# EasyEDA Pro project ProPrj_Inverted_MAML_6x6_2026-09-04(1).epro, schematic fpga_t120_etc2
Create Date: 2025-12-23; Page Name: P1; Project Name: FPGA_motors_V3_0_4; Schematic Name: fpga_t120_etc2; Update Date: 2025-12-23; Company: EasyEDA.com; Page Size: A4; Version: V1.0
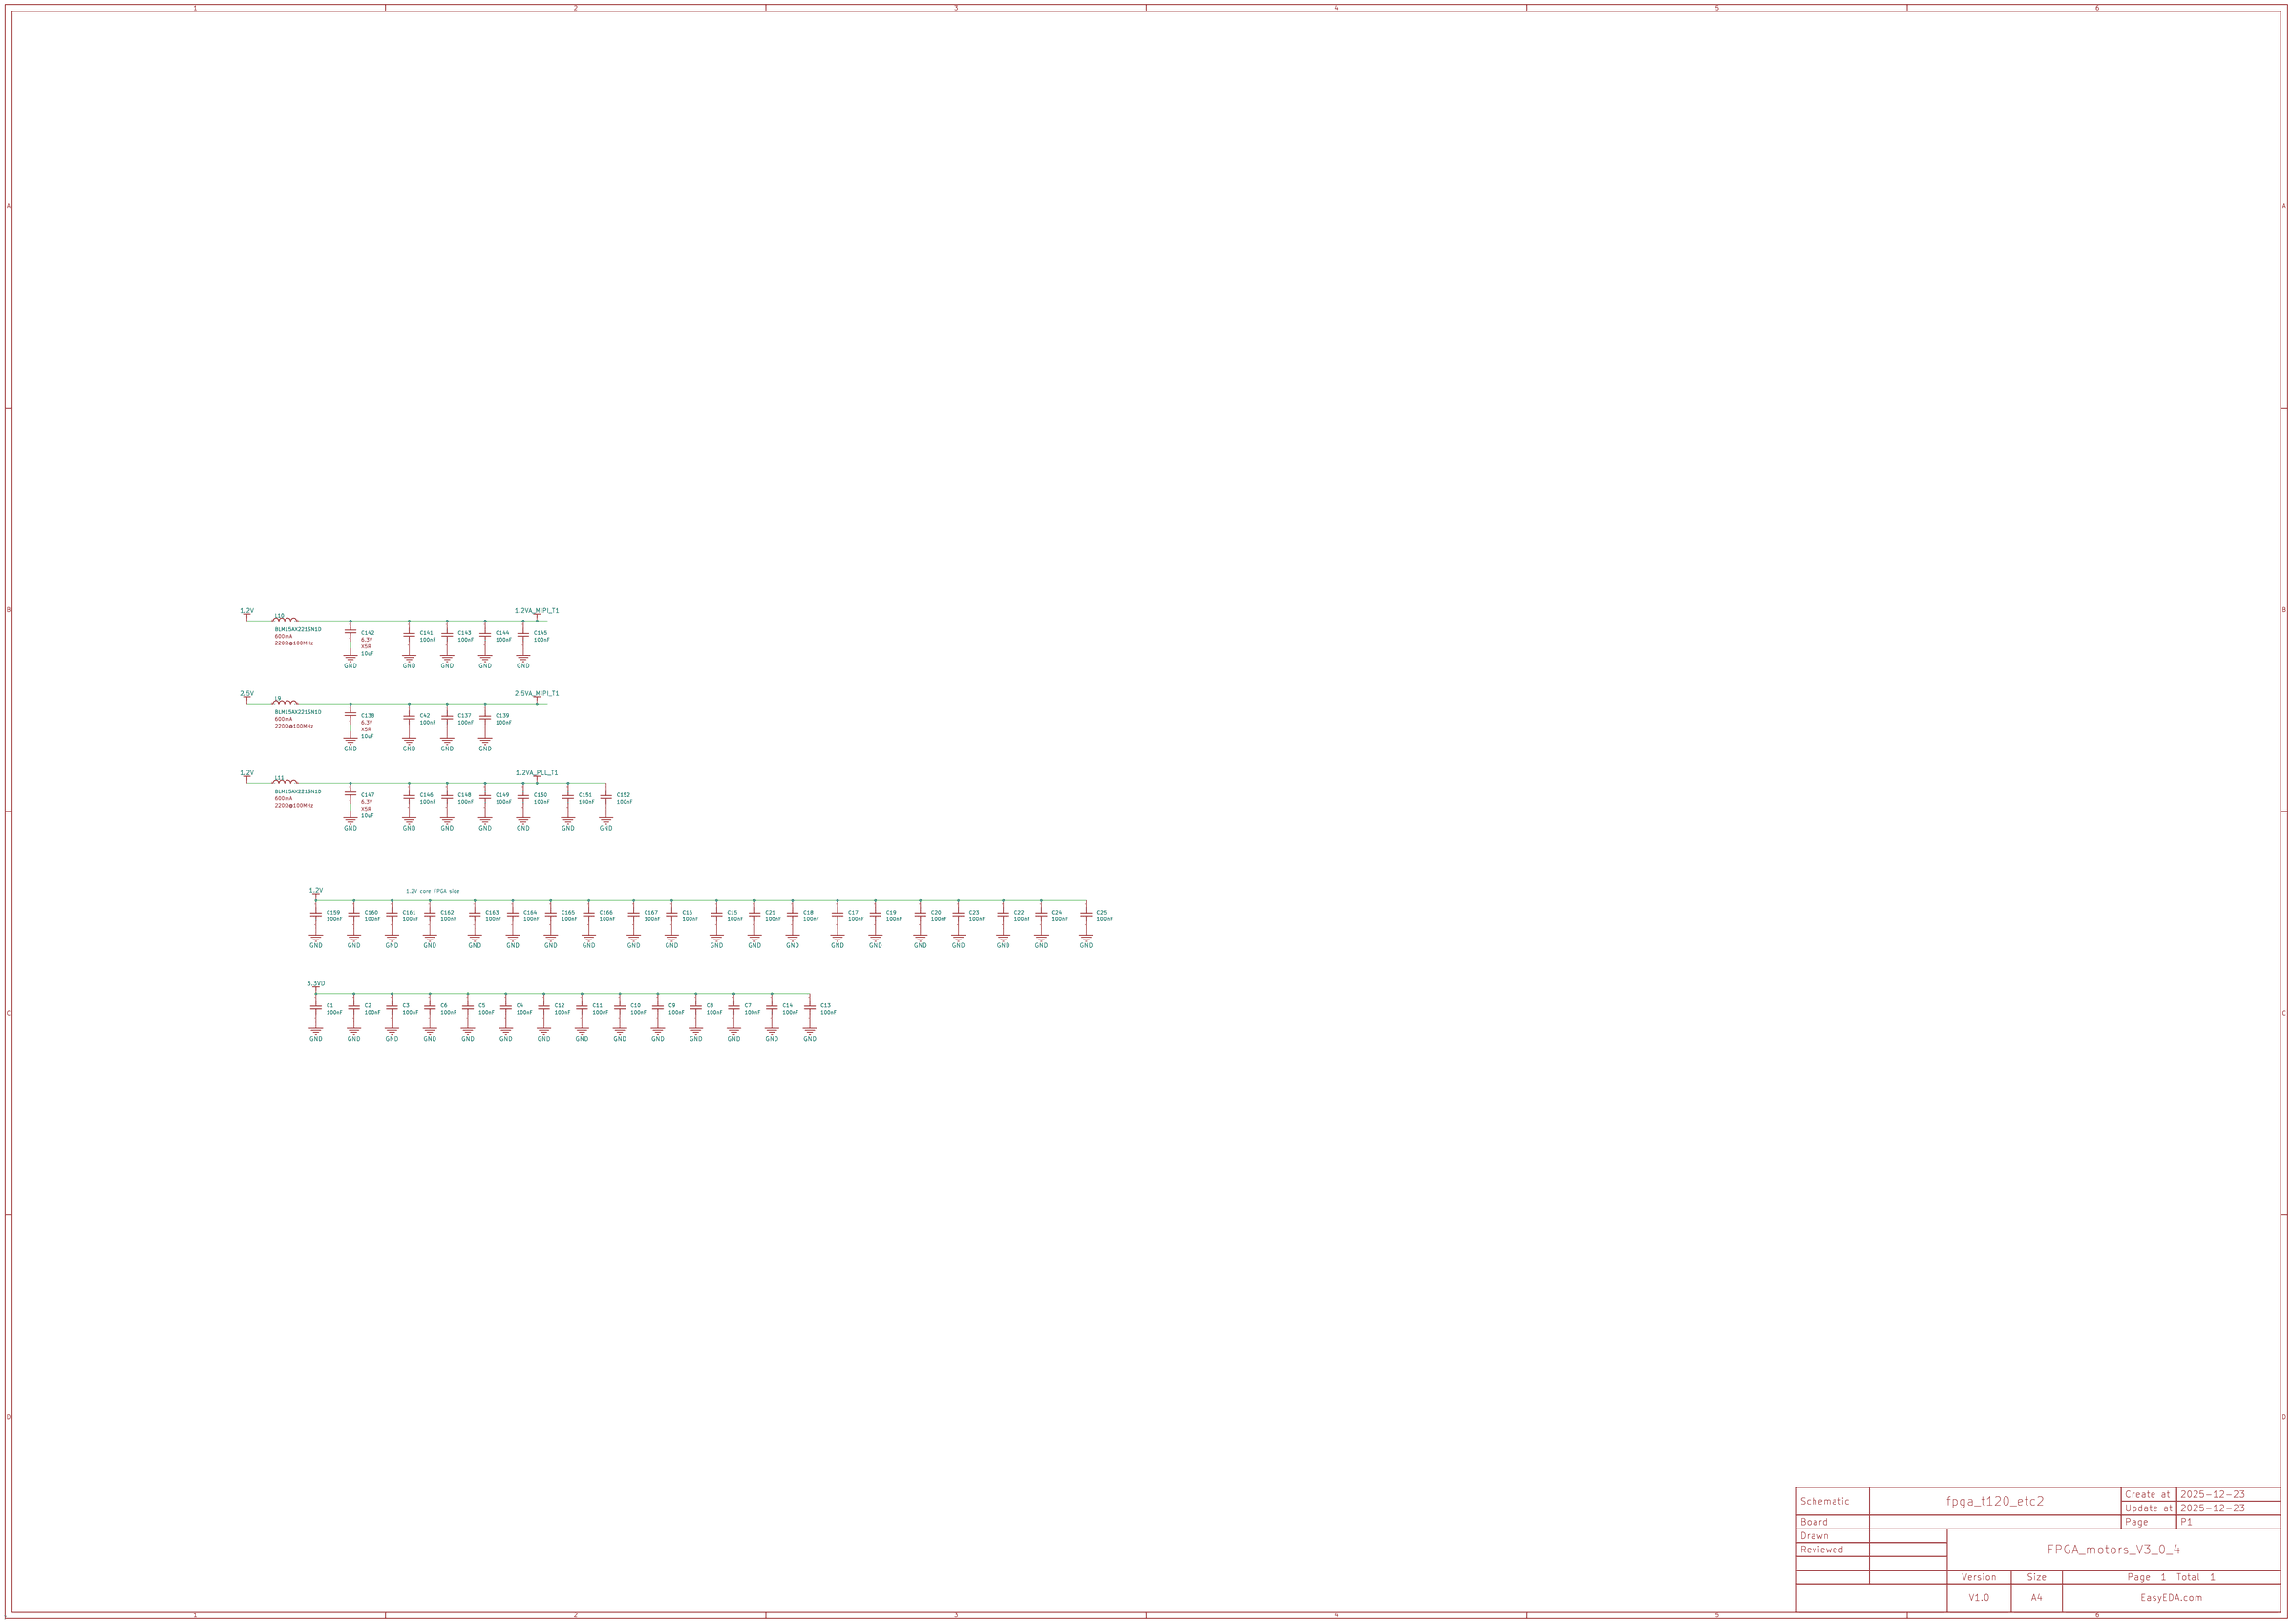
[diagram p2: schematic sheet]

## Parts
C1  100nF  [C0201]
C2  100nF  [C0201]
C3  100nF  [C0201]
C4  100nF  [C0201]
C5  100nF  [C0201]
C6  100nF  [C0201]
C7  100nF  [C0201]
C8  100nF  [C0201]
C9  100nF  [C0201]
C10  100nF  [C0201]
C11  100nF  [C0201]
C12  100nF  [C0201]
C13  100nF  [C0201]
C14  100nF  [C0201]
C15  100nF  [C0201]
C16  100nF  [C0201]
C17  100nF  [C0201]
C18  100nF  [C0201]
C19  100nF  [C0201]
C20  100nF  [C0201]
C21  100nF  [C0201]
C22  100nF  [C0201]
C23  100nF  [C0201]
C24  100nF  [C0201]
C25  100nF  [C0201]
C42  100nF  [C0201]
C137  100nF  [C0201]
C138  10uF  [C0402]
C139  100nF  [C0201]
C141  100nF  [C0201]
C142  10uF  [C0402]
C143  100nF  [C0201]
C144  100nF  [C0201]
C145  100nF  [C0201]
C146  100nF  [C0201]
C147  10uF  [C0402]
C148  100nF  [C0201]
C149  100nF  [C0201]
C150  100nF  [C0201]
C151  100nF  [C0201]
C152  100nF  [C0201]
C159  100nF  [C0201]
C160  100nF  [C0201]
C161  100nF  [C0201]
C162  100nF  [C0201]
C163  100nF  [C0201]
C164  100nF  [C0201]
C165  100nF  [C0201]
C166  100nF  [C0201]
C167  100nF  [C0201]
L9  BLM15AX221SN1D  [L0402]
L10  BLM15AX221SN1D  [L0402]
L11  BLM15AX221SN1D  [L0402]

## Library data of the parts
C1-C25 C42 C137 C139 C141 C143-C146 C148-C152 C159-C167 = CL03A104KP3NNNC: Capacitance:100nF Tolerance:±10% Tolerance:±10% Voltage Rating:10V Temperature Coefficient:X5R; LCSC Part Name: 100nF ±10% 10V; Supplier Part: C49062; Manufacturer: SAMSUNG(三星); Supplier Footprint: 0201; JLCPCB Part Class: Extended Part; Datasheet: https://item.szlcsc.com/datasheet/CL03A104KP3NNNC/50070.html; Supplier: LCSC; Tolerance: ±10%; Voltage Rating: 10V; Temperature Coefficient: X5R
C138 C142 C147 = CL05A106MQ5NUNC: Capacitance:10uF Tolerance:±20% Tolerance:±20% Voltage Rating:6.3V Temperature Coefficient:X5R; LCSC Part Name: 10uF ±20% 6.3V; Supplier Part: C15525; Manufacturer: SAMSUNG(三星); Supplier Footprint: 0402; JLCPCB Part Class: Basic Part; Datasheet: https://item.szlcsc.com/datasheet/CL05A106MQ5NUNC/16204.html; Supplier: LCSC; Tolerance: ±20%; Voltage Rating: 6.3V; Temperature Coefficient: X5R
L9-L11 = BLM15AX221SN1D: Impedance @ Frequency:220Ω@100MHz Tolerance:±25% Tolerance:±25% DC Resistance(DCR):180mΩ Current Rating:600mA Number of Circuits:1 Operating Temperature:-55℃~+125℃ Operating Temperature:-55℃~+125℃; LCSC Part Name: 单路 0402磁珠 阻抗220Ω@100MHz; Supplier Part: C76885; Manufacturer: muRata(村田); Supplier Footprint: 0402; JLCPCB Part Class: Extended Part; Datasheet: https://item.szlcsc.com/datasheet/BLM15AX221SN1D/78012.html; Supplier: LCSC; Impedance @ Frequency: 220Ω@100MHz; Tolerance: ±25%; DC Resistance(DCR): 180mΩ; Current Rating: 600mA; Number of Circuits: 1; Operating Temperature: -55℃~+125℃

## Nets
1.2V: C15.1 C16.1 C17.1 C18.1 C19.1 C20.1 C21.1 C22.1 C23.1 C24.1 C25.1 C159.1 C160.1 C161.1 C162.1 C163.1 C164.1 C165.1 C166.1 C167.1 L10.1 L11.1
1.2VA_MIPI_T1: C141.1 C142.2 C143.1 C144.1 C145.1 L10.2
1.2VA_PLL_T1: C146.1 C147.2 C148.1 C149.1 C150.1 C151.1 C152.1 L11.2
2.5V: L9.1
2.5VA_MIPI_T1: C42.1 C137.1 C138.2 C139.1 L9.2
3.3VD: C1.2 C2.2 C3.2 C4.2 C5.2 C6.2 C7.2 C8.2 C9.2 C10.2 C11.2 C12.2 C13.2 C14.2
GND: C1.1 C2.1 C3.1 C4.1 C5.1 C6.1 C7.1 C8.1 C9.1 C10.1 C11.1 C12.1 C13.1 C14.1 C15.2 C16.2 C17.2 C18.2 C19.2 C20.2 C21.2 C22.2 C23.2 C24.2 C25.2 C42.2 C137.2 C138.1 C139.2 C141.2 C142.1 C143.2 C144.2 C145.2 C146.2 C147.1 C148.2 C149.2 C150.2 C151.2 C152.2 C159.2 C160.2 C161.2 C162.2 C163.2 C164.2 C165.2 C166.2 C167.2

## Notes on the sheet
- 1.2V core FPGA side
